# EAGLE design MiniBee_revB_1 (EAGLE 5.06)
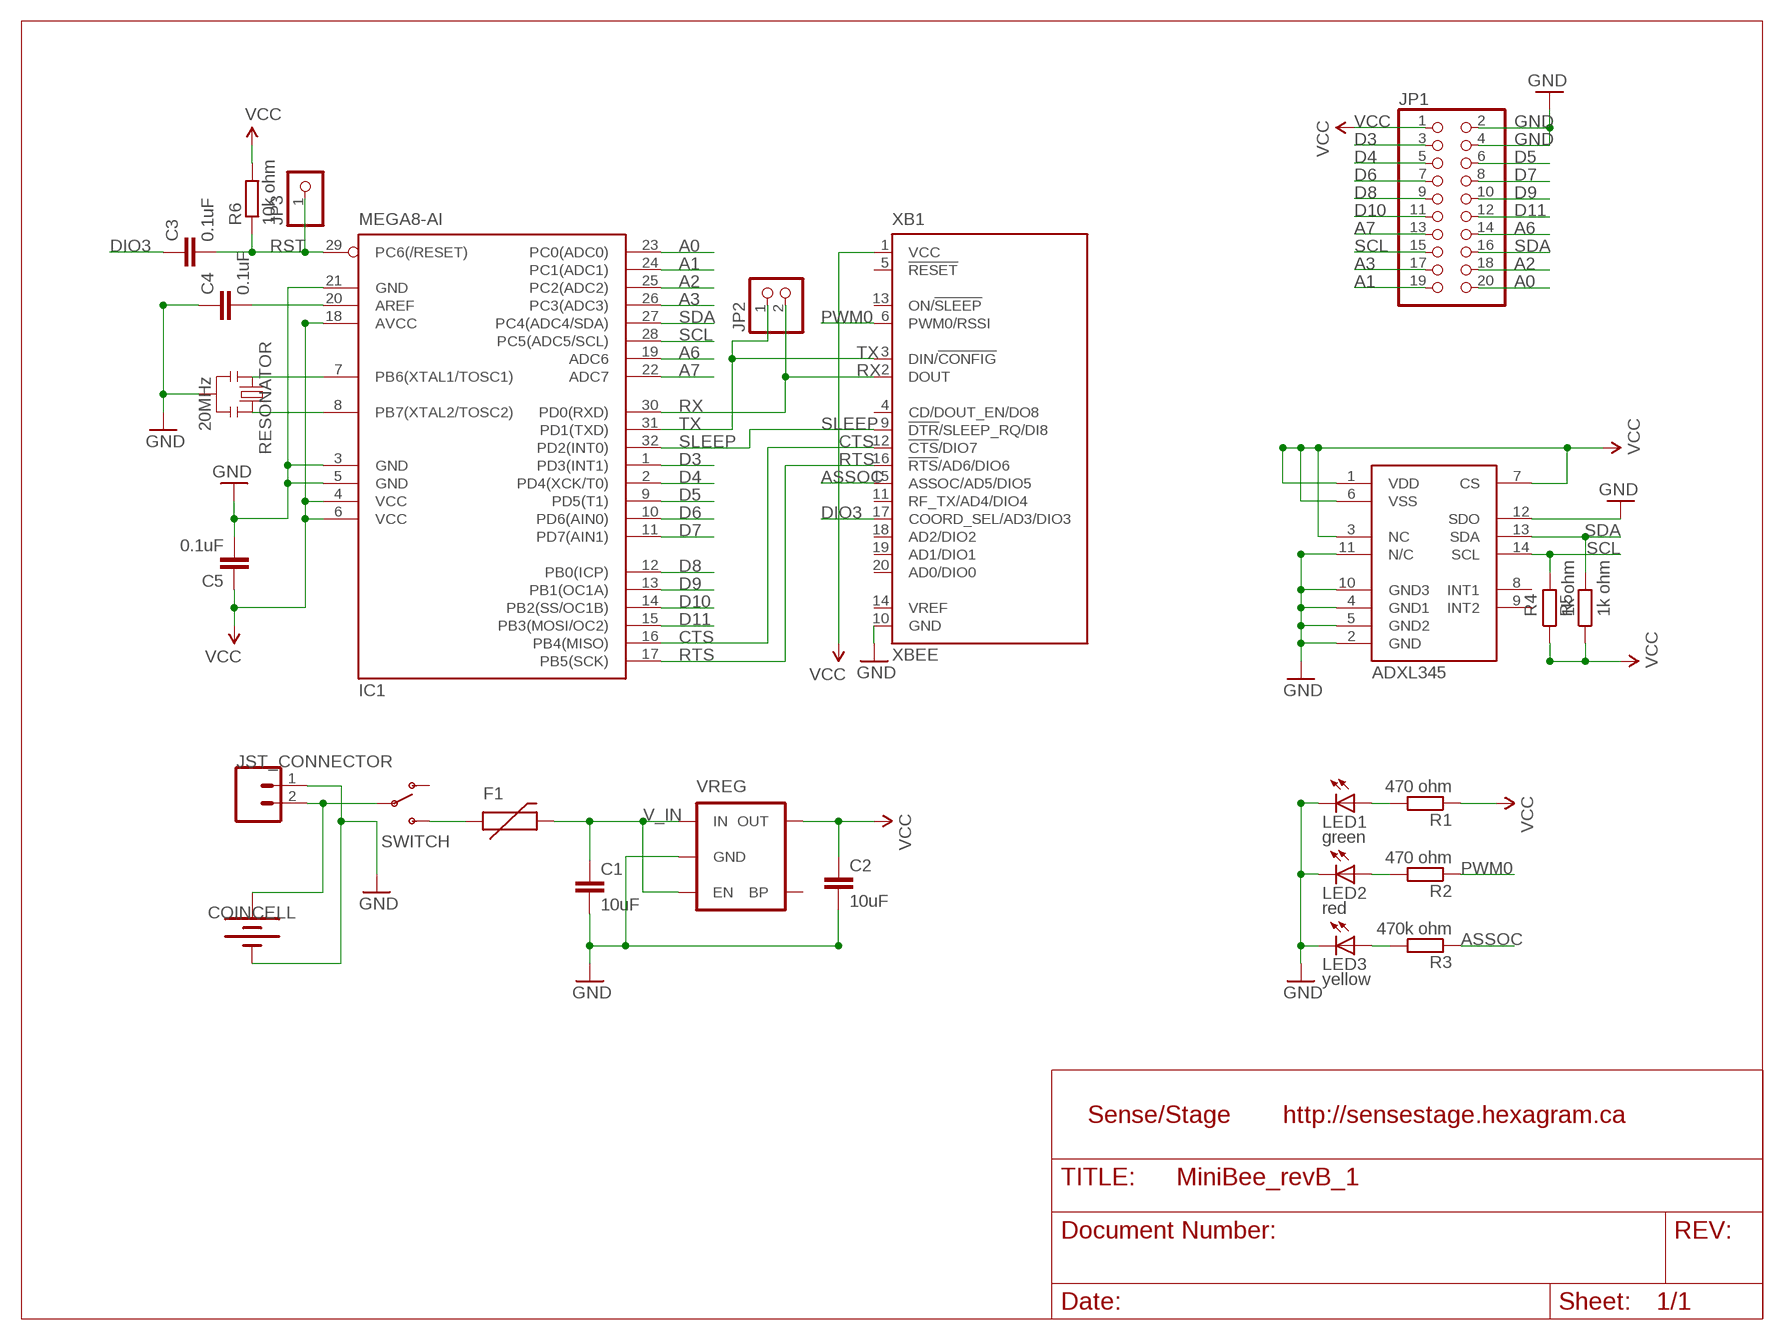
[diagram p0: schematic, sheet 1]

## Parts
C1  10uF  C-EUC0805  [C0805]
C2  10uF  C-EUC0805  [C0805]
C3  0.1uF  C-EUC0402  [C0402]
C4  0.1uF  C-EUC0402  [C0402]
C5  0.1uF  C-EUC0402  [C0402]
COINCELL  COINCELL  KEYSTONE_BATTERY_HOLDER  [KEYSTONE_BATTERY_HOLDER]
F1  PTCSMD  [PTC-1206]
IC1  MEGA8-AI  [TQFP32-08]
JP1  PINHD-2X10  [2X10]
JP2  PINHD-1X2  [1X02]
JP3  PINHD-1X1  [1X01]
JST_CONNECTOR  JST_CONNECTOR  M02-JST-2MM-SMT  [S2B-PH]
LED1  green  LEDCHIP-LED0603  [CHIP-LED0603]
LED2  red  LEDCHIP-LED0603  [CHIP-LED0603]
LED3  yellow  LEDCHIP-LED0603  [CHIP-LED0603]
R1  470 ohm  R-EU_R0402  [R0402]
R2  470 ohm  R-EU_R0402  [R0402]
R3  470k ohm  R-EU_R0402  [R0402]
R4  1k ohm  R-EU_R0402  [R0402]
R5  1k ohm  R-EU_R0402  [R0402]
R6  10k ohm  R-EU_R0402  [R0402]
RESONATOR  20MHz  RESONATORSMD  [RESONATOR-SMD]
SWITCH  SWITCH  PCM_SWITCH  [PCM_SWITCH_RA]
U1  ADXL345  [LGA14]
VREG  V_REG_LDOSMD  [SOT23-5]
XB1  XBEE  [XBEE]

## Nets
A0: IC1.23(PC0(ADC0)) JP1.20
A1: IC1.24(PC1(ADC1)) JP1.19
A2: IC1.25(PC2(ADC2)) JP1.18
A3: IC1.26(PC3(ADC3)) JP1.17
A6: IC1.19(ADC6) JP1.14
A7: IC1.22(ADC7) JP1.13
ASSOC: R3.1 XB1.15(ASSOC/AD5/DIO5)
CTS: IC1.16(PB4(MISO)) XB1.12(!CTS!/DIO7)
D3: IC1.1(PD3(INT1)) JP1.3
D4: IC1.2(PD4(XCK/T0)) JP1.5
D5: IC1.9(PD5(T1)) JP1.6
D6: IC1.10(PD6(AIN0)) JP1.7
D7: IC1.11(PD7(AIN1)) JP1.8
D8: IC1.12(PB0(ICP)) JP1.9
D9: IC1.13(PB1(OC1A)) JP1.10
D10: IC1.14(PB2(SS/OC1B)) JP1.11
D11: IC1.15(PB3(MOSI/OC2)) JP1.12
DIO3: C3.1 XB1.17(COORD_SEL/AD3/DIO3)
GND: C1.2 C2.2 C4.1 C5.2 COINCELL.- IC1.3(GND) IC1.5(GND) IC1.21(GND) JP1.2 JP1.4 JST_CONNECTOR.1 LED1.C LED2.C LED3.C RESONATOR.2 U1.2(GND) U1.4(GND1) U1.5(GND2) U1.10(GND3) U1.11(N/C) U1.12(SDO) VREG.2(GND) XB1.10(GND)
N$1: IC1.7(PB6(XTAL1/TOSC1)) RESONATOR.1
N$2: IC1.8(PB7(XTAL2/TOSC2)) RESONATOR.3
N$3: LED1.A R1.2
N$4: COINCELL.+ JST_CONNECTOR.2 SWITCH.2(P)
N$6: LED2.A R2.2
N$7: LED3.A R3.2
N$8: F1.1 SWITCH.3(S)
N$9: C4.2 IC1.20(AREF)
PWM0: R2.1 XB1.6(PWM0/RSSI)
RST: C3.2 IC1.29(PC6(/RESET)) JP3.1 R6.1
RTS: IC1.17(PB5(SCK)) XB1.16(!RTS!/AD6/DIO6)
RX: IC1.30(PD0(RXD)) JP2.2 XB1.2(DOUT)
SCL: IC1.28(PC5(ADC5/SCL)) JP1.15 R4.2 U1.14(SCL)
SDA: IC1.27(PC4(ADC4/SDA)) JP1.16 R5.2 U1.13(SDA)
SLEEP: IC1.32(PD2(INT0)) XB1.9(!DTR!/SLEEP_RQ/DI8)
TX: IC1.31(PD1(TXD)) JP2.1 XB1.3(DIN/!CONFIG)
V_IN: C1.1 F1.2 VREG.1(IN) VREG.3(EN)
VCC: C2.1 C5.1 IC1.4(VCC) IC1.6(VCC) IC1.18(AVCC) JP1.1 R1.1 R4.1 R5.1 R6.2 U1.1(VDD) U1.3(NC) U1.6(VSS) U1.7(CS) VREG.5(OUT) XB1.1(VCC)
Unconnected: SWITCH.1(O) U1.8(INT1) U1.9(INT2) VREG.4(BP) XB1.4(CD/DOUT_EN/DO8) XB1.5(!RESET) XB1.11(RF_TX/AD4/DIO4) XB1.13(ON/!SLEEP) XB1.14(VREF) XB1.18(AD2/DIO2) XB1.19(AD1/DIO1) XB1.20(AD0/DIO0)

## Notes on the sheet
- Sense/Stage | http://sensestage.hexagram.ca

## Library data of the parts
C1-C5 = rcl:C-EU: CAPACITOR, European symbol
COINCELL = myShit:KEYSTONE_BATTERY_HOLDER
F1 = SparkFun:PTC: Resettable Fuse PTC Resettable Fuse. Spark Fun Electronics SKU : COM-08357
IC1 = atmel:MEGA8: MICROCONTROLLER 8 Kbytes FLASH, 1 kbytes SRAM, 512 bytes EEPROM, USART, 6-channel 10 bit ADC, 2-channel 8 bit ADC Pin compatible with Atmega48, ATMega88, ATMega168 Source: avr.lbr
JP1 = myShit:PINHD-2X10: PIN HEADER
JP2 = myShit:PINHD-1X2: PIN HEADER
JP3 = myShit:PINHD-1X1: PIN HEADER
JST_CONNECTOR = SparkFun:M02: Header 2 Standard 2-pin 0.1" header. Use with straight break away headers (SKU : PRT-00116), right angle break away headers (PRT-00553), swiss pins (PRT-00743), machine pins (PRT-00117), and female headers (PRT-00115). Molex polarized connector foot print use with SKU : PRT-08233 with associated crimp pins and housings.
LED1-LED3 = led:LED: LED OSRAM: - CHIPLED LG R971, LG N971, LY N971, LG Q971, LY Q971, LO R971, LY R971 LH N974, LH R974 LS Q976, LO Q976, LY Q976 LO Q996 - Hyper CHIPLED LW Q18S LB Q993, LB Q99A, LB R99A - SideLED LS A670, LO A670, LY A670, LG A670, LP A670 LB A673, LV A673, LT A673, LW A673 LH A674 LY A675 LS A676, LA A676, LO A676, LY A676, LW A676 LS A679, LY A679, LG A679 - Hyper Micro SIDELED® LS Y876, LA Y876, LO Y876, LY Y876 LT Y87S - SmartLED LW L88C, LW L88S LB L89C, LB L89S, LG L890 LS L89K, LO L89K, LY L89K LS L896, LA L896, LO L896, LY L896 - TOPLED LS T670, LO T670, LY T670, LG T670, LP T670 LSG T670, LSP T670, LSY T670, LOP T670, LYG T670 LG T671, LOG T671, LSG T671 LB T673, LV T673, LT T673, LW T673 LH T674 LS T676, LA T676, LO T676, LY T676, LB T676, LH T676, LSB T676, LW T676 LB T67C, LV T67C, LT T67C, LS T67K, LO T67K, LY T67K, LW E67C LS E67B, LA E67B, LO E67B, LY E67B, LB E67C, LV E67C, LT E67C LW T67C LS T679, LY T679, LG T679 LS T770, LO T770, LY T770, LG T770, LP T770 LB T773, LV T773, LT T773, LW T773 LH T774 LS E675, LA E675, LY E675, LS T675 LS T776, LA T776, LO T776, LY T776, LB T776 LHGB T686 LT T68C, LB T68C - Hyper Mini TOPLED® LB M676 - Mini TOPLED Santana® LG M470 LS M47K, LO M47K, LY M47K Source: http://www.osram.convergy.de LUXEON: - LUMILED® LXK2-PW12-R00, LXK2-PW12-S00, LXK2-PW14-U00, LXK2-PW14-V00 LXK2-PM12-R00, LXK2-PM12-S00, LXK2-PM14-U00 LXK2-PE12-Q00, LXK2-PE12-R00, LXK2-PE12-S00, LXK2-PE14-T00, LXK2-PE14-U00 LXK2-PB12-K00, LXK2-PB12-L00, LXK2-PB12-M00, LXK2-PB14-N00, LXK2-PB14-P00, LXK2-PB14-Q00 LXK2-PR12-L00, LXK2-PR12-M00, LXK2-PR14-Q00, LXK2-PR14-R00 LXK2-PD12-Q00, LXK2-PD12-R00, LXK2-PD12-S00 LXK2-PH12-R00, LXK2-PH12-S00 LXK2-PL12-P00, LXK2-PL12-Q00, LXK2-PL12-R00 Source: www.luxeon.com KINGBRIGHT: KA-3528ASYC Source: www.kingbright.com
R1-R6 = rcl:R-EU_: RESISTOR, European symbol
RESONATOR = SparkFun:RESONATOR: Resonator Small SMD resonator. This is the itty bitty 10/20MHz resonators with built in caps. CSTCE10M0G55 and CSTCE20M0V53. Footprint has been reviewed closely but hasn't been tested yet.
SWITCH = myShit:PCM_SWITCH
U1 = SparkFun:ADXL345
VREG = SparkFun:V_REG_LDO: Voltage Regulator LDO Standard 150mA LDO voltage regulator in SOT-23 layout. Micrel part MIC5205. BP (by-pass) pin is used to lower output noise with 470pF cap.
XB1 = maxstream:XBEE: XBee (TM) /XBee-PRO(TM) OEM RF Modules Source: MaxStream, Inc. xbee_productmanual.pdf

## Board
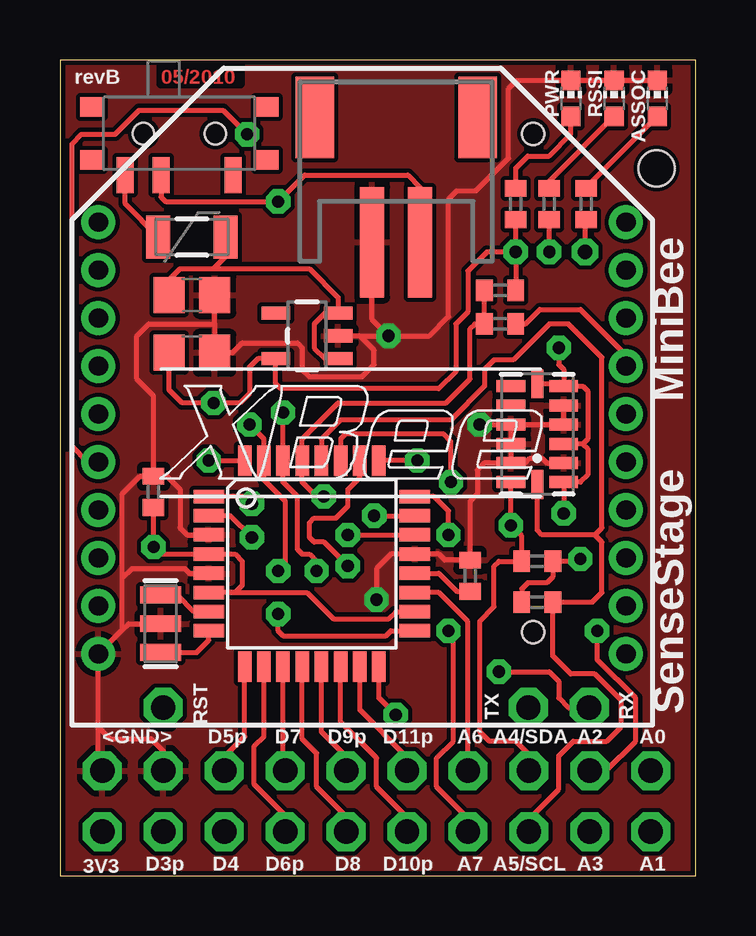
[diagram p1: board, top side]
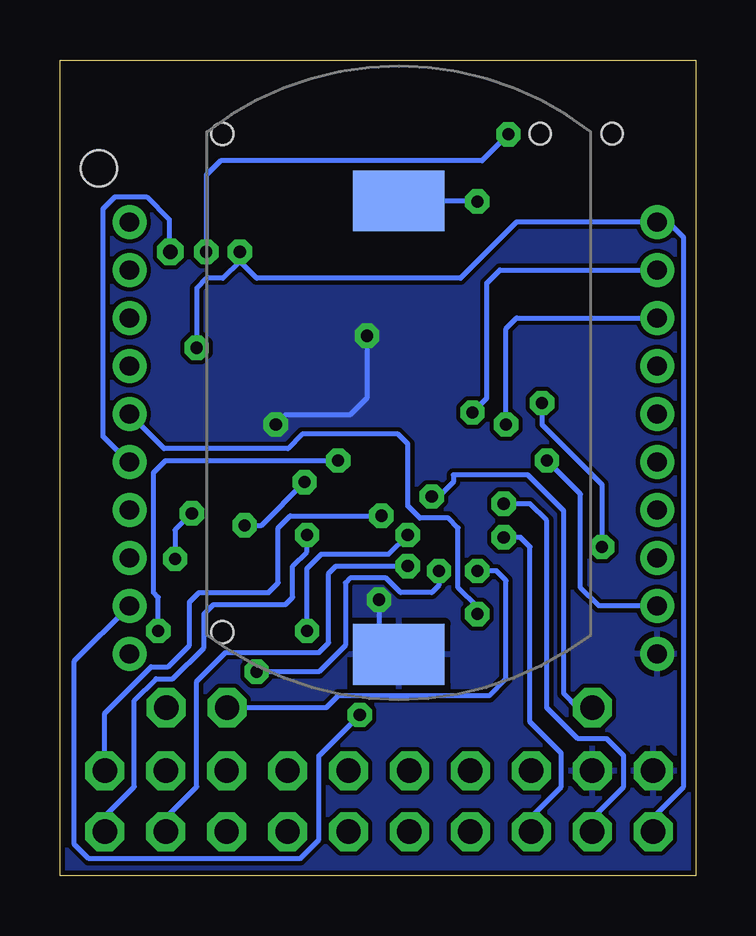
[diagram p2: board, bottom side, seen from below]

Size 26.5 x 34 mm. Coordinates in mm from the lower left corner, seen from the top.
Outline: 0,0 26.5,0 26.5,34 0,34 0,0
Copper layers (1*16): Top 0.035mm / dielectric 1.5mm / Bottom 0.035mm
Design rules "APC": minimum track width 7mil, minimum drill 20mil, track to track 7mil, track to pad 7mil, pad to pad 7mil, via to via 7mil, smd to smd 0mil, copper to edge 8mil, drill to drill 8mil, minimum pad ring 12mil, minimum via ring 10mil, stop-mask expansion 4mil, vias tented up to drill 25mil, thermal gap 10mil
Holes 1.5 mm at 24.87,29.48

### Footprints (pad centres in the part's own frame; a part is rotated, then mirrored left to right if it is on the bottom)
C0805 = smd 1.3 x 1.5: 1 -0.95,0; 2 0.95,0
C0402 = smd 0.7 x 0.9: 1 -0.65,0; 2 0.65,0
KEYSTONE_BATTERY_HOLDER = smd 2.54 x 3.81: + 7.595,0; - -11.303,0 | hole 0.914: 10.389,7.366; -10.389,7.366
PTC-1206 = smd 1 x 1.8: 1 -1.4,0; 2 1.4,0
TQFP32-08 = smd 1.27 x 0.559: 1 -4.293,2.8; 2 -4.293,2; 3 -4.293,1.2; 4 -4.293,0.4; 5 -4.293,-0.4; 6 -4.293,-1.2; 7 -4.293,-2; 8 -4.293,-2.8; 17 4.293,-2.8; 18 4.293,-2; 19 4.293,-1.2; 20 4.293,-0.4; 21 4.293,0.4; 22 4.293,1.2; 23 4.293,2; 24 4.293,2.8 | smd 0.559 x 1.27: 9 -2.8,-4.293; 10 -2,-4.293; 11 -1.2,-4.293; 12 -0.4,-4.293; 13 0.4,-4.293; 14 1.2,-4.293; 15 2,-4.293; 16 2.8,-4.293; 25 2.8,4.293; 26 2,4.293; 27 1.2,4.293; 28 0.4,4.293; 29 -0.4,4.293; 30 -1.2,4.293; 31 -2,4.293; 32 -2.8,4.293
2X10 = drill 1.016 octagon: 1 -11.43,-1.27; 2 -11.43,1.27; 3 -8.89,-1.27; 4 -8.89,1.27; 5 -6.35,-1.27; 6 -6.35,1.27; 7 -3.81,-1.27; 8 -3.81,1.27; 9 -1.27,-1.27; 10 -1.27,1.27; 11 1.27,-1.27; 12 1.27,1.27; 13 3.81,-1.27; 14 3.81,1.27; 15 6.35,-1.27; 16 6.35,1.27; 17 8.89,-1.27; 18 8.89,1.27; 19 11.43,-1.27; 20 11.43,1.27
1X02 = drill 1.016 octagon: 1 -1.27,0; 2 1.27,0
1X01 = drill 1.016 octagon: 1 0,0
S2B-PH = smd 1 x 4.6: 1 -1,-3.7; 2 1,-3.7 | smd 1.6 x 3.4: NC1 -3.4,1.5; NC2 3.4,1.5
CHIP-LED0603 = smd 0.8 x 0.8: A 0,-0.75; C 0,0.75
R0402 = smd 0.7 x 0.9: 1 -0.65,0; 2 0.65,0
RESONATOR-SMD = smd 0.7 x 1.7: 1 -1.2,0; 2 0,0; 3 1.2,0
PCM_SWITCH_RA = smd 0.711 x 1.499: 1 -2.235,1.74; 2 0.762,1.74; 3 2.261,1.74 | smd 0.991 x 0.813: P$1 -3.645,1.105; P$2 -3.645,-1.105; P$4 3.645,-1.105; P$5 3.645,1.105 | hole 0.889: 1.499,0; -1.499,0
LGA14 = smd 0.5 x 1.2: 1 2,1.1; 2 1.2,1.1; 3 0.4,1.1; 4 -0.4,1.1; 5 -1.2,1.1; 6 -2,1.1; 8 -2,-1.1; 9 -1.2,-1.1; 10 -0.4,-1.1; 11 0.4,-1.1; 12 1.2,-1.1; 13 2,-1.1 | smd 1.2 x 0.5: 7 -2.1,0; 14 2.1,0
SOT23-5 = smd 0.55 x 1.2: 1 -0.95,-1.3; 2 0,-1.3; 3 0.95,-1.3; 4 0.95,1.3; 5 -0.95,1.3
XBEE = drill 0.8 pad 1.27 round: 1 -11,9; 2 -11,7; 3 -11,5; 4 -11,3; 5 -11,1; 6 -11,-1; 7 -11,-3; 8 -11,-5; 9 -11,-7; 10 -11,-9; 11 11,-9; 12 11,-7; 13 11,-5; 14 11,-3; 15 11,-1; 16 11,1; 17 11,3; 18 11,5; 19 11,7; 20 11,9

### Placement (x,y rotation side)
C1  5.5,24.2 0 top
C2  5.5,21.8 0 top
C3  18.35,23 180 top
C4  17.1,12.5 270 top
C5  3.9,16 90 top
COINCELL  12.37,20.53 90 bottom
F1  5.5,26.62 0 top
IC1  10.5,13 0 top
JP1  13.2,3.1 0 top
JP2  20.8,7 0 top
JP3  4.3,7 0 top
JST_CONNECTOR  14.02,30.1 0 top
LED1  21.3,32.4 0 top
LED2  23.1,32.4 0 top
LED3  24.9,32.4 0 top
R1  19,28 90 top
R2  20.4,28 90 top
R3  21.94,28 90 top
R4  19.9,11.4 0 top
R5  19.9,13.1 180 top
R6  18.35,24.4 0 top
RESONATOR  4.2,10.5 270 top
SWITCH  4.98,30.93 180 top
U1  19.9,18.4 270 top
VREG  10.3,22.5 90 top
XB1  12.6,18.24 0 top

### Tracks (layer width: path | path; a pad name or v marks a point on that pad's centre or on a via)
A0  (via drill 0.51)
  Top 0.203: v13.1,15 IC1.23
  Bottom 0.203: JP1.20 24.63,6.77 22.7,8.7 22,8.7 21.1,9.6 21.1,11.4 20.7,11.8 17.8,11.8 17.4,12.2 17.4,14.5 16.9,15 v13.1,15
A1  (via drill 0.51)
  Top 0.203: IC1.24 15.6,15.8 16.2,15.2 v16.2,14.2
  Bottom 0.203: JP1.19 24.63,2.47 23.4,3.7 23.4,7.3 22.5,8.2 21.8,8.2 20.5,9.5 20.5,10.9 20.1,11.3 17.1,11.3 16.8,11.6 16.8,12.9 16.2,13.5 v16.2,14.2
A2  (via drill 0.51)
  Top 0.203: v22.4,10.2 22.4,9 24,7.4 24,5.6 22.77,4.37 JP1.18 | v14.9,17.3 IC1.25
  Bottom 0.203: v14.9,17.3 22.1,17.3 22.6,16.8 22.6,11.8 22.4,11.6 v22.4,10.2
A3  (via drill 0.51)
  Top 0.203: v12,12.9 11,13.9 10.6,13.9 10.4,14.1 10.4,14.7 10.6,14.9 11.5,14.9 12,15.4 12,16.1 12.5,16.6 IC1.26
  Bottom 0.203: v12,12.9 15,12.9 15.3,12.6 15.3,9.7 15.7,9.3 19.6,9.3 20.8,8.1 20.8,3.7 22.09,2.41 JP1.17
A6
  Top 0.203: JP1.14 17.01,10.59 15.8,11.8 IC1.19
A7  (via drill 0.51)
  Top 0.203: v12,14.2 IC1.22 | JP1.13 17.01,2.39 15.7,3.7 15.7,4.9 16.4,5.6 16.4,10 v16.2,10.2
  Bottom 0.203: v16.2,10.2 16.2,12.8 15.6,13.4 12.8,13.4 v12,14.2
ASSOC  (via drill 0.6)
  Top 0.203: v21.9,26 21.9,27.31 R3.1
  Bottom 0.203: XB1.15 23.64,17.24 24.7,18.3 24.7,27.8 24.2,28.3 22.89,28.3 R3.1 21.94,26.04 v21.9,26
CTS  (via drill 0.51)
  Top 0.203: IC1.16 13.3,7.4 v14,6.7
  Bottom 0.203: v14,6.7 15.7,5 15.7,1.5 16.5,0.7 25.3,0.7 25.9,1.3 25.9,8.94 XB1.12
D3  (via drill 0.51)
  Top 0.203: IC1.1 7.7,15.8 v8,15.5
  Bottom 0.203: JP1.3 4.31,2.39 3,3.7 3,5 3.7,5.7 4.9,5.7 6.2,7 6.2,14.8 6.9,15.5 v8,15.5
D4  (via drill 0.51)
  Top 0.203: v8,14.1 7.1,15 IC1.2
  Bottom 0.203: JP1.5 6.85,2.45 5.6,3.7 5.6,5.1 6.9,6.4 6.9,13.7 7.3,14.1 v8,14.1
D5
  Top 0.203: JP1.6 6.85,4.95 7.7,5.8 IC1.9
D6
  Top 0.203: JP1.7 9.39,2.51 8.1,3.8 8.1,5.4 8.5,5.8 IC1.10
D7
  Top 0.203: IC1.11 9.3,4.46 JP1.8
D8
  Top 0.203: JP1.9 11.93,2.47 10.7,3.7 10.7,5.1 10.1,5.7 IC1.12
D9
  Top 0.203: JP1.10 11.93,4.97 10.9,6 IC1.13
D10
  Top 0.203: JP1.11 14.47,2.43 13.2,3.7 13.2,4.9 11.7,6.4 IC1.14
D11
  Top 0.203: JP1.12 14.47,4.93 12.5,6.9 IC1.15
DIO3
  Top 0.203: XB1.17 23.6,21.7 21.7,23.6 20,23.6 19.4,23 C3.1
GND  (via drill 0.51)
  Top 0.203: 6.45,23 C2.2 7.2,21.8 7.6,22.2 9.9,22.2 10.1,22 10.1,21.1 10.4,20.8 12.6,20.8 13.1,21.3 13.1,21.9 12.5,22.5 | 6.45,23 C1.2 | U1.10 U1.11 U1.12 | U1.10 U1.4 U1.5 | U1.12 19.4,17.2 19.6,17.4 20.1,17.4 20.3,17.2 U1.2 | U1.12 17.7,17.2 17.4,16.9 17.4,15.9 17.1,15.6 C4.1 16.05,13.15 15.8,13.4 IC1.21 13.8,13.4 13.2,12.8 v13.2,11.5 | v17.5,18.8 U1.10 | 12.5,22.5 v13.7,22.5 | C5.2 3.35,16.65 2.6,15.9 2.6,12.4 | IC1.5 5.4,12.6 5.2,12.8 3,12.8 2.6,12.4 | 6.45,23 3.7,23 3.2,22.5 3.2,20.7 3.9,20 C5.2 | v13.7,22.5 15.4,22.5 16.2,23.3 16.2,28.2 16.55,28.55 17.35,28.55 18.7,29.9 18.7,32.8 19.05,33.15 LED1.C LED2.C LED3.C | JST_CONNECTOR.1 13.02,23.18 v13.7,22.5 | 12.5,22.5 VREG.2 | C5.2 3.8,16.75 | IC1.3 5.3,14.2 5,14.5 5,16.1 4.45,16.65 C5.2 | 2.6,10.24 2.6,12.4 | 1.6,6.2 1.6,4.54 JP1.2 | 1.6,6.2 XB1.10 2.6,10.24 | JP1.4 4.31,5.19 3.8,5.7 2.1,5.7 1.6,6.2 | RESONATOR.2 2.86,10.5 2.6,10.24
  Bottom 0.203: 11.94,8.8 COINCELL.- 13.2,10.06 v13.2,11.5 | v17.5,18.8 17.1,19.2 14.4,19.2 13.7,19.9 v13.7,22.5
  pour Top: 0,34 26.5,34 26.5,0 0,0
  pour Bottom: 0,34 26.5,34 26.5,0 0,0
N$1
  Top 0.203: IC1.7 5.6,11 4.9,11.7 RESONATOR.1
N$2
  Top 0.203: IC1.8 6.21,9.81 5.7,9.3 RESONATOR.3
N$3
  Top 0.203: R1.2 19,29.5 19.5,30 20.4,30 21.3,30.9 LED1.A
N$4  (via drill 0.51)
  Top 0.203: JST_CONNECTOR.2 15.02,28.68 14.5,29.2 10.2,29.2 v9.1,28.1 4.4,28.1 4.22,28.28 SWITCH.2
  Bottom 0.203: COINCELL.+ 9.12,28.12 v9.1,28.1
N$6
  Top 0.203: R2.2 20.4,28.95 LED2.A
N$7
  Top 0.203: R3.2 21.94,28.69 LED3.A
N$8
  Top 0.203: SWITCH.3 2.72,28 F1.1
N$9
  Top 0.203: C4.2 16.55,11.85 15.8,12.6 IC1.20
PWM0  (via drill 0.51)
  Top 0.203: XB1.6 1.16,17.24 0.5,17.9 0.5,30.5 0.9,30.9 2.3,30.9 3.3,31.9 6.8,31.9 v7.8,30.9 | v20.4,26 R2.1
  Bottom 0.203: v20.4,26 20.4,29.2 19.8,29.8 8.9,29.8 v7.8,30.9
RST  (via drill 0.51)
  Top 0.203: R6.1 C3.2 17.3,23 17.1,22.8 17.1,20.7 16.1,19.7 11.6,19.7 10.1,18.2 IC1.29 10.1,16.4 10.7,15.8 v11,15.8
  Bottom 0.203: v11,15.8 10.7,15.8 10.1,16.4 10.1,16.7 7,16.7 5.5,15.2 5.5,7.6 4.9,7 JP3.1
RTS  (via drill 0.51)
  Top 0.203: IC1.17 13.8,10.2 13.6,10 9.3,10 9.1,10.2 v9.1,10.9
  Bottom 0.203: XB1.16 22.16,17.8 17,17.8 16.4,18.4 12.4,18.4 12,18 12,15.4 11.5,14.9 10.3,14.9 9.9,14.5 9.9,12 9.1,11.2 v9.1,10.9
RX  (via drill 0.51)
  Top 0.203: v9.3,19.3 IC1.30 9.3,16.4 9.9,15.8 9.9,13.6 10.1,13.4 10.4,13.4 10.7,13.1 v10.7,12.7 | v18.3,8.5 20.4,8.5 20.8,8.1 20.8,7.4 21.2,7 JP2.2
  Bottom 0.203: v18.3,8.5 15.7,8.5 14.6,9.6 14.6,12.2 14.4,12.4 12.9,12.4 12.3,11.8 11,11.8 10.7,12.1 v10.7,12.7 | XB1.2 8.16,25.24 8.7,24.7 8.7,19.9 v9.3,19.3
SCL
  Top 0.203: JP1.15 19.55,2.35 20.8,3.6 20.8,5 21.4,5.6 22.8,5.6 23.4,6.2 23.4,7.3 22.3,8.4 21.3,8.4 20.55,9.15 R4.2 22.2,11.4 22.6,11.8 22.6,13.9 22.3,14.2 | U1.14 19.9,14.4 20.1,14.2 22.3,14.2 | IC1.28 10.9,18.2 11.7,19 16.3,19 17.7,20.4 17.7,21.1 18.1,21.5 18.9,21.5 20.4,23 21.2,23 22.6,21.6 22.6,14.5 22.3,14.2
SDA  (via drill 0.51)
  Top 0.203: IC1.27 11.7,18.2 11.9,18.4 16,18.4 16.3,18.1 v16.3,16.4 | JP1.16 19.55,5.05 19,5.6 17.9,5.6 17.5,6 17.5,10.6 18.1,11.2 18.1,12.9 18.3,13.1 R5.2 19.25,14.15 v18.8,14.6 U1.13
  Bottom 0.203: v16.3,16.4 18.1,14.6 v18.8,14.6
SLEEP  (via drill 0.51)
  Top 0.203: v6.2,17.3 IC1.32
  Bottom 0.203: v6.2,17.3 4.8,15.9 4.8,12 4.04,11.24 XB1.9
TX  (via drill 0.51)
  Top 0.203: v7.9,18.8 8.5,18.2 IC1.31 8.5,16.5 9.4,15.6 9.4,13 v9.1,12.7
  Bottom 0.203: JP2.1 15.4,7 14.9,7.5 8.6,7.5 7.9,8.2 7.9,12.3 8.3,12.7 v9.1,12.7 | XB1.3 7.46,23.24 7.9,22.8 v7.9,18.8
V_IN
  Top 0.203: VREG.1 11.05,21.55 10.6,22 10.6,23 11.05,23.45 VREG.3 11.6,24.1 10.4,25.3 6.4,25.3 | C1.1 4.55,24.85 5,25.3 6.4,25.3 | 6.4,25.3 6.9,25.8 F1.2
VCC  (via drill 0.51)
  Top 0.203: 7,11.8 7.3,11.8 7.6,12.1 7.6,13.1 7.3,13.4 IC1.4 4.2,13.4 v3.9,13.7 C5.1 | 7,11.8 IC1.6 | v19,26 R1.1 | R4.1 19.25,11.95 19.5,12.2 20.3,12.2 20.55,12.45 R5.1 21.6,13.1 v21.7,13.2 | U1.7 20.9,20.5 U1.6 | U1.6 21.8,20.4 22,20.2 22,18.2 21.8,18 | 21.8,18 U1.3 | 21.8,18 22,17.8 22,16.7 21.7,16.4 U1.1 v21,15.1 | U1.6 21.1,20.5 | IC1.18 14,11 13.7,10.7 11.4,10.7 10.3,11.8 7,11.8 | C2.1 4.55,20.25 5.1,19.7 v6.4,19.7 7.5,19.7 7.9,20.1 7.9,21.2 8.25,21.55 VREG.5 9,20.5 9.2,20.3 15.8,20.3 16.5,21 16.5,23 17,23.5 17,25.2 17.8,26 v19,26 | v19,26 R6.2 | v20.8,22 20.8,21.3 21,21.1 U1.6
  Bottom 0.203: 19,25.6 18.3,24.9 9.8,24.9 7.46,27.24 XB1.1 1.14,27.24 0.5,26.6 0.5,3.7 1.77,2.43 JP1.1 | 19,25.6 v19,26 | 19,25.6 19.7,24.9 20.4,24.9 20.8,24.5 v20.8,22 | v21.7,13.2 21.7,14.4 v21,15.1 | v3.9,13.7 3.9,16.3 6.4,18.8 v6.4,19.7

### Text on the board
Top: 05/2010
_tsilk: PWR | RSSI | ASSOC | revB | MiniBee | SenseStage | <GND> | D5p | RST | D7 | D9p | D11p | A6 | A4/SDA | TX | A2 | RX | A0 | 3V3 | D3p | D4 | D6p | D8 | D10p | A7 | A5/SCL | A3 | A1